# Altium schematic sheet PLD_Local-Supply.SchDoc: Local Supply
size A3; SheetTotal: 32
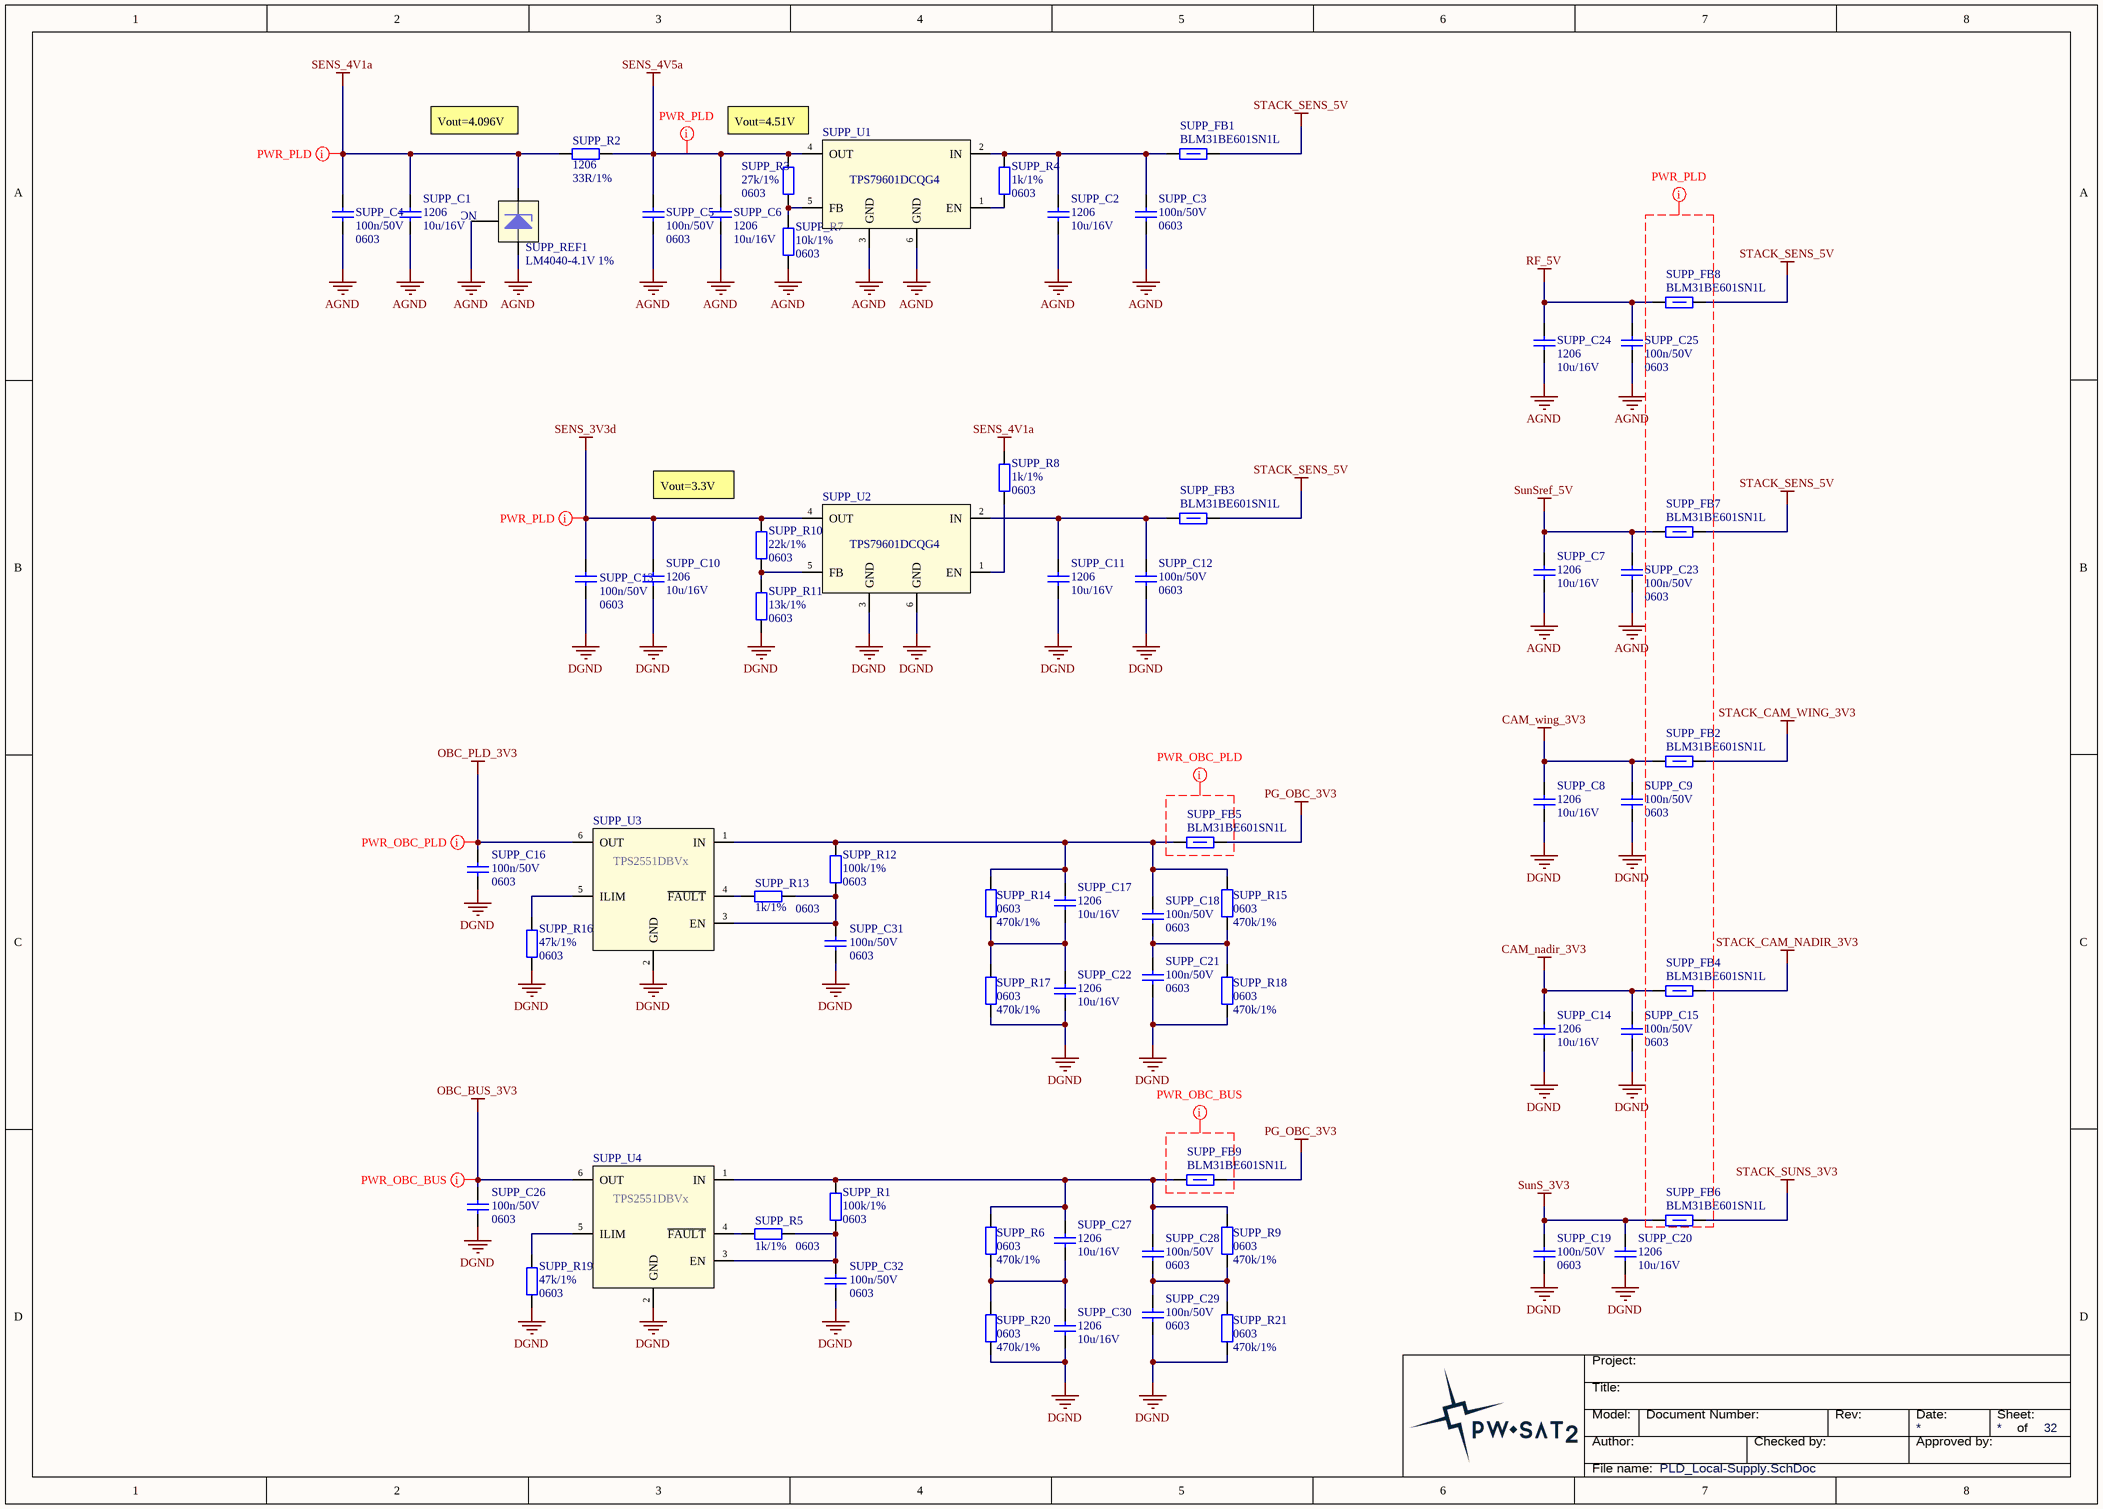
[diagram p0: PLD_Local-Supply.SchDoc]

## Parts
SUPP_C1  Packge: 1206  [SMD_Capacitor_1206]  (hidden comment: 10u/16V)
SUPP_C2  Packge: 1206  [SMD_Capacitor_1206]  (hidden comment: 10u/16V)
SUPP_C3  Package: 0603  [SMD_Capacitor_0603]  (hidden comment: 100n/50V)
SUPP_C4  Package: 0603  [SMD_Capacitor_0603]  (hidden comment: 100n/50V)
SUPP_C5  Package: 0603  [SMD_Capacitor_0603]  (hidden comment: 100n/50V)
SUPP_C6  Packge: 1206  [SMD_Capacitor_1206]  (hidden comment: 10u/16V)
SUPP_C7  Packge: 1206  [SMD_Capacitor_1206]  (hidden comment: 10u/16V)
SUPP_C8  Packge: 1206  [SMD_Capacitor_1206]  (hidden comment: 10u/16V)
SUPP_C9  Package: 0603  [SMD_Capacitor_0603]  (hidden comment: 100n/50V)
SUPP_C10  Packge: 1206  [SMD_Capacitor_1206]  (hidden comment: 10u/16V)
SUPP_C11  Packge: 1206  [SMD_Capacitor_1206]  (hidden comment: 10u/16V)
SUPP_C12  Package: 0603  [SMD_Capacitor_0603]  (hidden comment: 100n/50V)
SUPP_C13  Package: 0603  [SMD_Capacitor_0603]  (hidden comment: 100n/50V)
SUPP_C14  Packge: 1206  [SMD_Capacitor_1206]  (hidden comment: 10u/16V)
SUPP_C15  Package: 0603  [SMD_Capacitor_0603]  (hidden comment: 100n/50V)
SUPP_C16  Package: 0603  [SMD_Capacitor_0603]  (hidden comment: 100n/50V)
SUPP_C17  Packge: 1206  [SMD_Capacitor_1206]  (hidden comment: 10u/16V)
SUPP_C18  Package: 0603  [SMD_Capacitor_0603]  (hidden comment: 100n/50V)
SUPP_C19  Package: 0603  [SMD_Capacitor_0603]  (hidden comment: 100n/50V)
SUPP_C20  Packge: 1206  [SMD_Capacitor_1206]  (hidden comment: 10u/16V)
SUPP_C21  Package: 0603  [SMD_Capacitor_0603]  (hidden comment: 100n/50V)
SUPP_C22  Packge: 1206  [SMD_Capacitor_1206]  (hidden comment: 10u/16V)
SUPP_C23  Package: 0603  [SMD_Capacitor_0603]  (hidden comment: 100n/50V)
SUPP_C24  Packge: 1206  [SMD_Capacitor_1206]  (hidden comment: 10u/16V)
SUPP_C25  Package: 0603  [SMD_Capacitor_0603]  (hidden comment: 100n/50V)
SUPP_C26  Package: 0603  [SMD_Capacitor_0603]  (hidden comment: 100n/50V)
SUPP_C27  Packge: 1206  [SMD_Capacitor_1206]  (hidden comment: 10u/16V)
SUPP_C28  Package: 0603  [SMD_Capacitor_0603]  (hidden comment: 100n/50V)
SUPP_C29  Package: 0603  [SMD_Capacitor_0603]  (hidden comment: 100n/50V)
SUPP_C30  Packge: 1206  [SMD_Capacitor_1206]  (hidden comment: 10u/16V)
SUPP_C31  Package: 0603  [SMD_Capacitor_0603]  (hidden comment: 100n/50V)
SUPP_C32  Package: 0603  [SMD_Capacitor_0603]  (hidden comment: 100n/50V)
SUPP_FB1  ManufacturerPartNumber: BLM31BE601SN1L  [1206]  (hidden comment: 600R/100MHz)
SUPP_FB2  ManufacturerPartNumber: BLM31BE601SN1L  [1206]  (hidden comment: 600R/100MHz)
SUPP_FB3  ManufacturerPartNumber: BLM31BE601SN1L  [1206]  (hidden comment: 600R/100MHz)
SUPP_FB4  ManufacturerPartNumber: BLM31BE601SN1L  [1206]  (hidden comment: 600R/100MHz)
SUPP_FB5  ManufacturerPartNumber: BLM31BE601SN1L  [1206]  (hidden comment: 600R/100MHz)
SUPP_FB6  ManufacturerPartNumber: BLM31BE601SN1L  [1206]  (hidden comment: 600R/100MHz)
SUPP_FB7  ManufacturerPartNumber: BLM31BE601SN1L  [1206]  (hidden comment: 600R/100MHz)
SUPP_FB8  ManufacturerPartNumber: BLM31BE601SN1L  [1206]  (hidden comment: 600R/100MHz)
SUPP_FB9  ManufacturerPartNumber: BLM31BE601SN1L  [1206]  (hidden comment: 600R/100MHz)
SUPP_R1  Package: 0603  [SMD_Resistor_0603]  (hidden comment: 100k/1%)
SUPP_R2  Package: 1206  [SMD_Resistor_1206]  (hidden comment: 33R/1%)
SUPP_R3  Package: 0603  [SMD_Resistor_0603]  (hidden comment: 27k/1%)
SUPP_R4  Package: 0603  [SMD_Resistor_0603]  (hidden comment: 1k/1%)
SUPP_R5  Package: 0603  [SMD_Resistor_0603]  (hidden comment: 1k/1%)
SUPP_R6  Package: 0603  [SMD_Resistor_0603]  (hidden comment: 470k/1%)
SUPP_R7  Package: 0603  [SMD_Resistor_0603]  (hidden comment: 10k/1%)
SUPP_R8  Package: 0603  [SMD_Resistor_0603]  (hidden comment: 1k/1%)
SUPP_R9  Package: 0603  [SMD_Resistor_0603]  (hidden comment: 470k/1%)
SUPP_R10  Package: 0603  [SMD_Resistor_0603]  (hidden comment: 22k/1%)
SUPP_R11  Package: 0603  [SMD_Resistor_0603]  (hidden comment: 13k/1%)
SUPP_R12  Package: 0603  [SMD_Resistor_0603]  (hidden comment: 100k/1%)
SUPP_R13  Package: 0603  [SMD_Resistor_0603]  (hidden comment: 1k/1%)
SUPP_R14  Package: 0603  [SMD_Resistor_0603]  (hidden comment: 470k/1%)
SUPP_R15  Package: 0603  [SMD_Resistor_0603]  (hidden comment: 470k/1%)
SUPP_R16  Package: 0603  [SMD_Resistor_0603]  (hidden comment: 47k/1%)
SUPP_R17  Package: 0603  [SMD_Resistor_0603]  (hidden comment: 470k/1%)
SUPP_R18  Package: 0603  [SMD_Resistor_0603]  (hidden comment: 470k/1%)
SUPP_R19  Package: 0603  [SMD_Resistor_0603]  (hidden comment: 47k/1%)
SUPP_R20  Package: 0603  [SMD_Resistor_0603]  (hidden comment: 470k/1%)
SUPP_R21  Package: 0603  [SMD_Resistor_0603]  (hidden comment: 470k/1%)
SUPP_REF1  LM4040-4.1V 1%  [SOT23-3]
SUPP_U1  (no value)  [TI-DCQ]
SUPP_U2  (no value)  [TI-DCQ]
SUPP_U3  TPS2551DBVx  [SOT23-6]
SUPP_U4  TPS2551DBVx  [SOT23-6]

## Nets
AGND: SUPP_C1.2 SUPP_C2.2 SUPP_C3.2 SUPP_C4.2 SUPP_C5.2 SUPP_C6.2 SUPP_C7.2 SUPP_C23.1 SUPP_C24.2 SUPP_C25.1 SUPP_R7.2 SUPP_REF1.2(A) SUPP_REF1.3(NC) SUPP_U1.3(GND) SUPP_U1.6(GND)
CAM_nadir_3V3: SUPP_C14.1 SUPP_C15.1 SUPP_FB4.2
CAM_wing_3V3: SUPP_C8.1 SUPP_C9.1 SUPP_FB2.2
DGND: SUPP_C8.2 SUPP_C9.2 SUPP_C10.2 SUPP_C11.2 SUPP_C12.2 SUPP_C13.2 SUPP_C14.2 SUPP_C15.2 SUPP_C16.1 SUPP_C19.2 SUPP_C20.2 SUPP_C21.2 SUPP_C22.2 SUPP_C26.1 SUPP_C29.2 SUPP_C30.2 SUPP_C31.1 SUPP_C32.1 SUPP_R11.2 SUPP_R16.2 SUPP_R17.2 SUPP_R18.2 SUPP_R19.2 SUPP_R20.2 SUPP_R21.2 SUPP_U2.3(GND) SUPP_U2.6(GND) SUPP_U3.2(GND) SUPP_U4.2(GND)
OBC_BUS_3V3: SUPP_C26.2 SUPP_U4.6(OUT)
OBC_PLD_3V3: SUPP_C16.2 SUPP_U3.6(OUT)
PG_OBC_3V3: SUPP_FB5.1 SUPP_FB9.1
RF_5V: SUPP_C24.1 SUPP_C25.2 SUPP_FB8.2
SENS_3V3d: SUPP_C10.1 SUPP_C13.1 SUPP_R10.1 SUPP_U2.4(OUT)
SENS_4V1a: SUPP_C1.1 SUPP_C4.1 SUPP_R2.1 SUPP_R8.1 SUPP_REF1.1(K)
SENS_4V5a: SUPP_C5.1 SUPP_C6.1 SUPP_R2.2 SUPP_R3.1 SUPP_U1.4(OUT)
STACK_CAM_NADIR_3V3: SUPP_FB4.1
STACK_CAM_WING_3V3: SUPP_FB2.1
STACK_SENS_5V: SUPP_FB1.1 SUPP_FB3.1 SUPP_FB7.1 SUPP_FB8.1
STACK_SUNS_3V3: SUPP_FB6.1
SunS_3V3: SUPP_C19.1 SUPP_C20.1 SUPP_FB6.2
SunSref_5V: SUPP_C7.1 SUPP_C23.2 SUPP_FB7.2
NetSUPP_C2_1: SUPP_C2.1 SUPP_C3.1 SUPP_FB1.2 SUPP_R4.1 SUPP_U1.2(IN)
NetSUPP_C11_1: SUPP_C11.1 SUPP_C12.1 SUPP_FB3.2 SUPP_U2.2(IN)
NetSUPP_C17_1: SUPP_C17.1 SUPP_C18.1 SUPP_FB5.2 SUPP_R12.1 SUPP_R14.1 SUPP_R15.1 SUPP_U3.1(IN)
NetSUPP_C17_2: SUPP_C17.2 SUPP_C22.1 SUPP_R14.2 SUPP_R17.1
NetSUPP_C18_2: SUPP_C18.2 SUPP_C21.1 SUPP_R15.2 SUPP_R18.1
NetSUPP_C27_1: SUPP_C27.1 SUPP_C28.1 SUPP_FB9.2 SUPP_R1.1 SUPP_R6.1 SUPP_R9.1 SUPP_U4.1(IN)
NetSUPP_C27_2: SUPP_C27.2 SUPP_C30.1 SUPP_R6.2 SUPP_R20.1
NetSUPP_C28_2: SUPP_C28.2 SUPP_C29.1 SUPP_R9.2 SUPP_R21.1
NetSUPP_C31_2: SUPP_C31.2 SUPP_R12.2 SUPP_R13.2 SUPP_U3.3(EN)
NetSUPP_C32_2: SUPP_C32.2 SUPP_R1.2 SUPP_R5.2 SUPP_U4.3(EN)
NetSUPP_R3_2: SUPP_R3.2 SUPP_R7.1 SUPP_U1.5(FB)
NetSUPP_R4_2: SUPP_R4.2 SUPP_U1.1(EN)
NetSUPP_R5_1: SUPP_R5.1 SUPP_U4.4(~{FAULT})
NetSUPP_R8_2: SUPP_R8.2 SUPP_U2.1(EN)
NetSUPP_R10_2: SUPP_R10.2 SUPP_R11.1 SUPP_U2.5(FB)
NetSUPP_R13_1: SUPP_R13.1 SUPP_U3.4(~{FAULT})
NetSUPP_R16_1: SUPP_R16.1 SUPP_U3.5(ILIM)
NetSUPP_R19_1: SUPP_R19.1 SUPP_U4.5(ILIM)

## Layout directives
net class PWR_OBC_PLD: (no net found under the mark), OBC_PLD_3V3
net class PWR_PLD: (no net found under the mark), SENS_3V3d, SENS_4V1a, SENS_4V5a
net class PWR_OBC_BUS: (no net found under the mark), OBC_BUS_3V3

## Notes on the sheet
- Vout=4.096V
- Vout=4.51V
- (near SUPP_R10) Vout=3.3V
- Title:
- Project:
- Author:
- Model:
- Document Number:
- Checked by:
- Rev:
- Date:
- Approved by:
- Sheet:
- of
- File name:

## Library data of the parts
SUPP_C1 SUPP_C2 SUPP_C6-SUPP_C8 SUPP_C10 SUPP_C11 SUPP_C14 SUPP_C17 SUPP_C20 SUPP_C22 SUPP_C24 SUPP_C27 SUPP_C30 = Cer_C1206T106K4RACTU: Ceramic Cap Kemet COTS 10u/16V X7R 1206; ManufacturerPartNumber: C1206T106K4RACTU; Manufacturer: Kemet; Value: 10u/16V
SUPP_C3-SUPP_C5 SUPP_C9 SUPP_C12 SUPP_C13 SUPP_C15 SUPP_C16 SUPP_C18 SUPP_C19 SUPP_C21 SUPP_C23 SUPP_C25 SUPP_C26 SUPP_C28 SUPP_C29 SUPP_C31 SUPP_C32 = Cer_C0603T104K5RALTU: Ceramic Cap Kemet COTS 100n/50V X7R 0603; Manufacturer: Kemet; ManufacturerPartNumber: C0603T104K5RALTU; Value: 100n/50V
SUPP_FB1-SUPP_FB9 = FerriteBead: Ferrite Bead; Manufacturer: Murata; HelpUrl: http://www.mouser.com/ds/2/281/c31e-794748.pdf; Supplier 1: Mouser; Value: 600R/100MHz; Mouser: 81-BLM31B601S
SUPP_R1 SUPP_R12 = CRCW0603100KFKxxxx: 100k/1% Vishay CRCW 0603 Resistor. 100mW, 100ppm, 75V.; Manufacturer: Vishay; ManufacturerPartNumber: CRCW0603100KFKxxxx; Value: 100k/1%
SUPP_R2 = CRCW120633R0FKxxxx: 33R/1% Vishay CRCW 1206 Resistor. 250mW, 100ppm, 200V.; ManufacturerPartNumber: CRCW120633R0FKxxxx; Manufacturer: Vishay; Value: 33R/1%
SUPP_R3 SUPP_R10 SUPP_R11 = Res
  SUPP_R3: Value: 27k/1%
  SUPP_R10: Value: 22k/1%
  SUPP_R11: Value: 13k/1%
SUPP_R4 SUPP_R5 SUPP_R8 SUPP_R13 = CRCW06031K00FKxxxx: 1k/1% Vishay CRCW 0603 Resistor. 100mW, 100ppm, 75V.; Manufacturer: Vishay; ManufacturerPartNumber: CRCW06031K00FKxxxx; Value: 1k/1%
SUPP_R6 SUPP_R9 SUPP_R14 SUPP_R15 SUPP_R17 SUPP_R18 SUPP_R20 SUPP_R21 = CRCW0603470KFKxxxx: 470k/1% Vishay CRCW 0603 Resistor. 100mW, 100ppm, 75V.; Manufacturer: Vishay; ManufacturerPartNumber: CRCW0603470KFKxxxx; Value: 470k/1%
SUPP_R7 = CRCW060310K0FKxxxx: 10k/1% Vishay CRCW 0603 Resistor. 100mW, 100ppm, 75V.; Manufacturer: Vishay; ManufacturerPartNumber: CRCW060310K0FKxxxx; Value: 10k/1%
SUPP_R16 SUPP_R19 = CRCW060347K0FKxxxx: 47k/1% Vishay CRCW 0603 Resistor. 100mW, 100ppm, 75V.; Manufacturer: Vishay; ManufacturerPartNumber: CRCW060347K0FKxxxx; Value: 47k/1%
SUPP_REF1 = LM4040CIM3-4.1: Shunt V-REF, 4.096V, 1%, SOT23-3; Manufacturer: Texas Instruments; ManufacturerPartNumber: LM4040CIM3-4.1; HelpUrl: http://www.ti.com/lit/ds/symlink/lm4040-n.pdf; Value: LM4040-4.1V 1%
SUPP_U1 SUPP_U2 = TPS79601DCQG4: 1A, Ajdustable LDO, Ultralow-Noise, High PSRR, Fast, RF; Manufacturer: Texas Instruments; ManufacturerPartNumber: TPS79601DCQG4; HelpUrl: http://www.ti.com/lit/ds/slvs351p/slvs351p.pdf
SUPP_U3 SUPP_U4 = TPS2551DBVx: Adjustable Current-Limited Power-Distribution Switch.; Manufacturer: Texas Instruments; Value: TPS2551DBVx